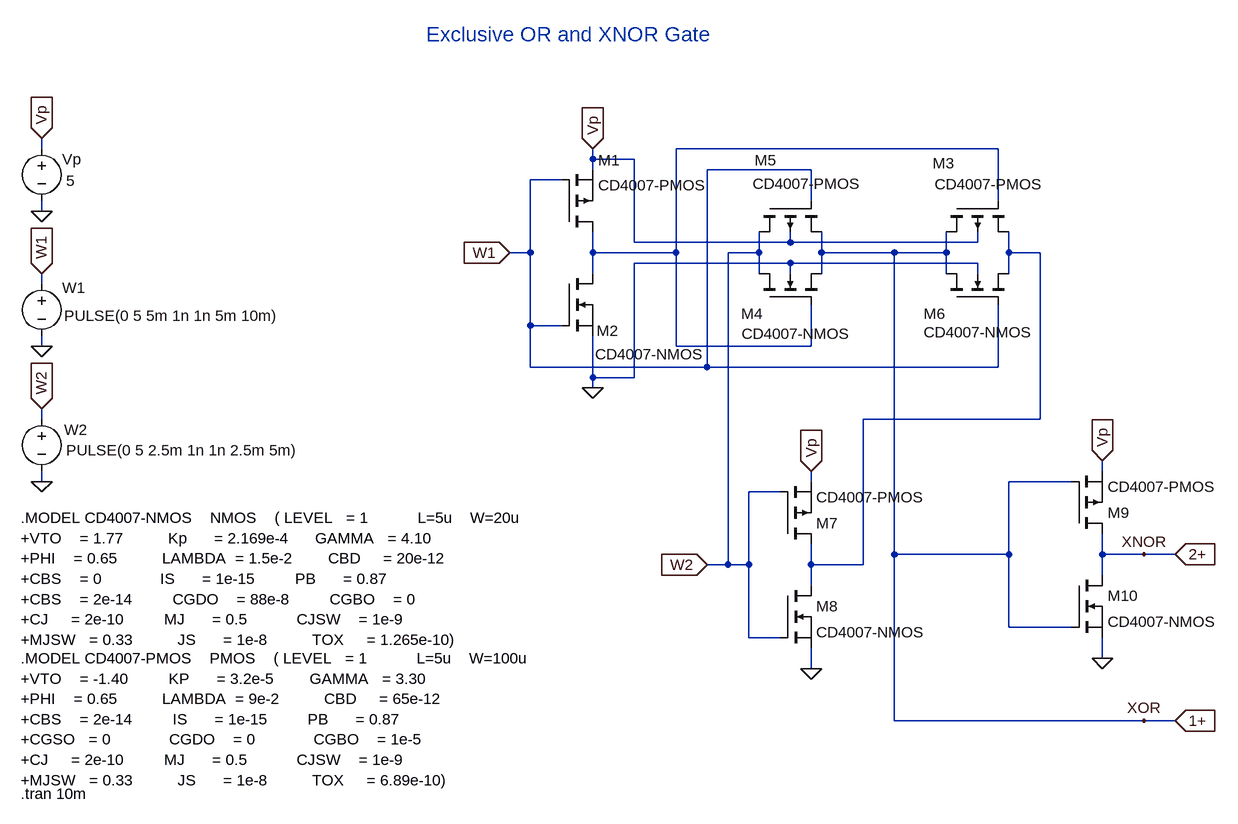
[diagram p0: schematic cmos_logic_gate_xor_and_xnor.asc]
cmos_logic_gate_xor_and_xnor.asc, the LTspice schematic file:
Version 4
SHEET 1 1036 1192
WIRE -1104 112 -1104 96
WIRE 368 112 -128 112
WIRE -256 128 -256 112
WIRE -192 128 -256 128
WIRE -256 144 -256 128
WIRE 80 144 -80 144
WIRE -304 160 -352 160
WIRE 80 192 80 144
WIRE 368 192 368 112
WIRE -1104 208 -1104 192
WIRE -192 256 -192 128
WIRE 48 256 48 240
WIRE 48 256 -192 256
WIRE 336 256 336 240
WIRE 336 256 48 256
WIRE -352 272 -352 160
WIRE -352 272 -384 272
WIRE -256 272 -256 240
WIRE -128 272 -128 112
WIRE -128 272 -256 272
WIRE 0 272 0 240
WIRE 0 272 -48 272
WIRE 96 272 96 240
WIRE 208 272 96 272
WIRE 288 272 288 240
WIRE 288 272 208 272
WIRE 384 272 384 240
WIRE 432 272 384 272
WIRE 48 288 -192 288
WIRE 336 288 48 288
WIRE -256 304 -256 272
WIRE 0 304 0 272
WIRE 48 304 48 288
WIRE 96 304 96 272
WIRE 288 304 288 272
WIRE 336 304 336 288
WIRE 384 304 384 272
WIRE -1104 320 -1104 304
WIRE -352 384 -352 272
WIRE -304 384 -352 384
WIRE -1104 416 -1104 400
WIRE -128 416 -128 272
WIRE 80 416 80 352
WIRE 80 416 -128 416
WIRE -352 448 -352 384
WIRE -80 448 -80 144
WIRE -80 448 -352 448
WIRE 368 448 368 352
WIRE 368 448 -80 448
WIRE -256 464 -256 400
WIRE -192 464 -192 288
WIRE -192 464 -256 464
WIRE -256 480 -256 464
WIRE -1104 528 -1104 512
WIRE 432 528 432 272
WIRE 432 528 160 528
WIRE 528 608 528 592
WIRE -1104 624 -1104 608
WIRE 80 624 80 608
WIRE 480 624 384 624
WIRE 32 640 -16 640
WIRE 208 736 208 272
WIRE 384 736 384 624
WIRE 384 736 208 736
WIRE 528 736 528 704
WIRE 592 736 528 736
WIRE 640 736 592 736
WIRE -48 752 -48 272
WIRE -48 752 -80 752
WIRE -16 752 -16 640
WIRE -16 752 -48 752
WIRE 80 752 80 720
WIRE 160 752 160 528
WIRE 160 752 80 752
WIRE 528 768 528 736
WIRE 80 784 80 752
WIRE 384 848 384 736
WIRE 480 848 384 848
WIRE -16 864 -16 752
WIRE 32 864 -16 864
WIRE 528 896 528 864
WIRE 80 912 80 880
WIRE 208 992 208 736
WIRE 592 992 208 992
WIRE 640 992 592 992
FLAG -256 480 0
FLAG -256 112 Vp
IOPIN -256 112 In
FLAG -384 272 W1
IOPIN -384 272 In
FLAG -80 752 W2
IOPIN -80 752 In
FLAG 640 992 1+
IOPIN 640 992 In
FLAG 80 912 0
FLAG -1104 416 0
FLAG -1104 208 0
FLAG -1104 96 Vp
IOPIN -1104 96 In
FLAG -1104 304 W1
IOPIN -1104 304 In
FLAG -1104 624 0
FLAG -1104 512 W2
IOPIN -1104 512 In
FLAG 80 608 Vp
IOPIN 80 608 In
FLAG 528 896 0
FLAG 528 592 Vp
IOPIN 528 592 In
FLAG 640 736 2+
IOPIN 640 736 In
FLAG 592 992 XOR
FLAG 592 736 XNOR
SYMBOL pmos -304 240 M180
WINDOW 0 56 110 Left 2
SYMATTR InstName M1
SYMATTR Value CD4007-PMOS
SYMBOL pmos 32 720 M180
SYMATTR InstName M7
SYMATTR Value CD4007-PMOS
SYMBOL nmos -304 304 R0
WINDOW 0 54 88 Left 2
WINDOW 3 52 124 Left 2
SYMATTR InstName M2
SYMATTR Value CD4007-NMOS
SYMBOL nmos 32 784 R0
SYMATTR InstName M8
SYMATTR Value CD4007-NMOS
SYMBOL voltage -1104 304 R0
WINDOW 3 35 65 Left 2
WINDOW 123 0 0 Left 0
WINDOW 39 0 0 Left 0
WINDOW 0 32 22 Left 2
SYMATTR Value PULSE(0 5 5m 1n 1n 5m 10m)
SYMATTR InstName W1
SYMBOL voltage -1104 96 R0
WINDOW 123 0 0 Left 0
WINDOW 39 0 0 Left 0
WINDOW 0 32 32 Left 2
WINDOW 3 38 65 Left 2
SYMATTR InstName Vp
SYMATTR Value 5
SYMBOL voltage -1104 512 R0
WINDOW 3 38 64 Left 2
WINDOW 123 0 0 Left 0
WINDOW 39 0 0 Left 0
WINDOW 0 35 32 Left 2
SYMATTR Value PULSE(0 5 2.5m 1n 1n 2.5m 5m)
SYMATTR InstName W2
SYMBOL pmos4 0 192 M90
WINDOW 0 -62 27 VLeft 2
WINDOW 3 -26 157 VLeft 2
SYMATTR InstName M5
SYMATTR Value CD4007-PMOS
SYMBOL pmos4 288 192 M90
WINDOW 0 -58 13 VLeft 2
WINDOW 3 -25 149 VLeft 2
SYMATTR InstName M3
SYMATTR Value CD4007-PMOS
SYMBOL nmos4 0 352 R270
WINDOW 0 -14 -28 VRight 2
WINDOW 3 -45 -27 VRight 2
SYMATTR InstName M4
SYMATTR Value CD4007-NMOS
SYMBOL nmos4 288 352 R270
WINDOW 0 -14 -35 VRight 2
WINDOW 3 -42 -35 VRight 2
SYMATTR InstName M6
SYMATTR Value CD4007-NMOS
SYMBOL pmos 480 704 M180
SYMATTR InstName M9
SYMATTR Value CD4007-PMOS
SYMBOL nmos 480 768 R0
SYMATTR InstName M10
SYMATTR Value CD4007-NMOS
TEXT -512 -64 Left 3 ;Exclusive OR and XNOR Gate
TEXT -1136 680 Left 2 !.MODEL CD4007-NMOS    NMOS    ( LEVEL   = 1           L=5u    W=20u             \n+VTO    = 1.77          Kp      = 2.169e-4      GAMMA   = 4.10  \n+PHI    = 0.65          LAMBDA  = 1.5e-2        CBD     = 20e-12\n+CBS    = 0             IS      = 1e-15         PB      = 0.87\n+CBS    = 2e-14         CGDO    = 88e-8         CGBO    = 0\n+CJ     = 2e-10         MJ      = 0.5           CJSW    = 1e-9\n+MJSW   = 0.33          JS      = 1e-8          TOX     = 1.265e-10)
TEXT -1136 896 Left 2 !.MODEL CD4007-PMOS    PMOS    ( LEVEL   = 1           L=5u    W=100u                \n+VTO    = -1.40         KP      = 3.2e-5        GAMMA   = 3.30  \n+PHI    = 0.65          LAMBDA  = 9e-2          CBD     = 65e-12\n+CBS    = 2e-14         IS      = 1e-15         PB      = 0.87\n+CGSO   = 0             CGDO    = 0             CGBO    = 1e-5\n+CJ     = 2e-10         MJ      = 0.5           CJSW    = 1e-9\n+MJSW   = 0.33          JS      = 1e-8          TOX     = 6.89e-10)
TEXT -1136 1104 Left 2 !.tran 10m

The netlist it stands for:
* cmos_logic_gate_xor_and_xnor.asc
M1 N001 W1 Vp Vp CD4007-PMOS
M7 N002 W2 Vp Vp CD4007-PMOS
M2 N001 W1 0 0 CD4007-NMOS
M8 N002 W2 0 0 CD4007-NMOS
V§W1 W1 0 PULSE(0 5 5m 1n 1n 5m 10m)
Vp Vp 0 5
V§W2 W2 0 PULSE(0 5 2.5m 1n 1n 2.5m 5m)
M5 W2 W1 XOR Vp CD4007-PMOS
M3 XOR N001 N002 Vp CD4007-PMOS
M4 W2 N001 XOR 0 CD4007-NMOS
M6 XOR W1 N002 0 CD4007-NMOS
M9 XNOR XOR Vp Vp CD4007-PMOS
M10 XNOR XOR 0 0 CD4007-NMOS
.model NMOS NMOS
.model PMOS PMOS
.lib standard.mos
* Exclusive OR and XNOR Gate
.MODEL CD4007-NMOS    NMOS    ( LEVEL   = 1           L=5u    W=20u
+VTO    = 1.77          Kp      = 2.169e-4      GAMMA   = 4.10
+PHI    = 0.65          LAMBDA  = 1.5e-2        CBD     = 20e-12
+CBS    = 0             IS      = 1e-15         PB      = 0.87
+CBS    = 2e-14         CGDO    = 88e-8         CGBO    = 0
+CJ     = 2e-10         MJ      = 0.5           CJSW    = 1e-9
+MJSW   = 0.33          JS      = 1e-8          TOX     = 1.265e-10)
.MODEL CD4007-PMOS    PMOS    ( LEVEL   = 1           L=5u    W=100u
+VTO    = -1.40         KP      = 3.2e-5        GAMMA   = 3.30
+PHI    = 0.65          LAMBDA  = 9e-2          CBD     = 65e-12
+CBS    = 2e-14         IS      = 1e-15         PB      = 0.87
+CGSO   = 0             CGDO    = 0             CGBO    = 1e-5
+CJ     = 2e-10         MJ      = 0.5           CJSW    = 1e-9
+MJSW   = 0.33          JS      = 1e-8          TOX     = 6.89e-10)
.tran 10m
.backanno
.end